# Altium schematic sheet Ctrl-PWM.SchDoc: I2C to PWM Controller
size Letter; ApprovedBy: k.cotton; Engineer: K.Cotton; Organization: Cegep Limoilou; Address1: 1300, 8e Avenue; Address2: Québec, QC; Address3: Canada; Address4: G1J 5L5; SheetNumber: 4; SheetTotal: 5
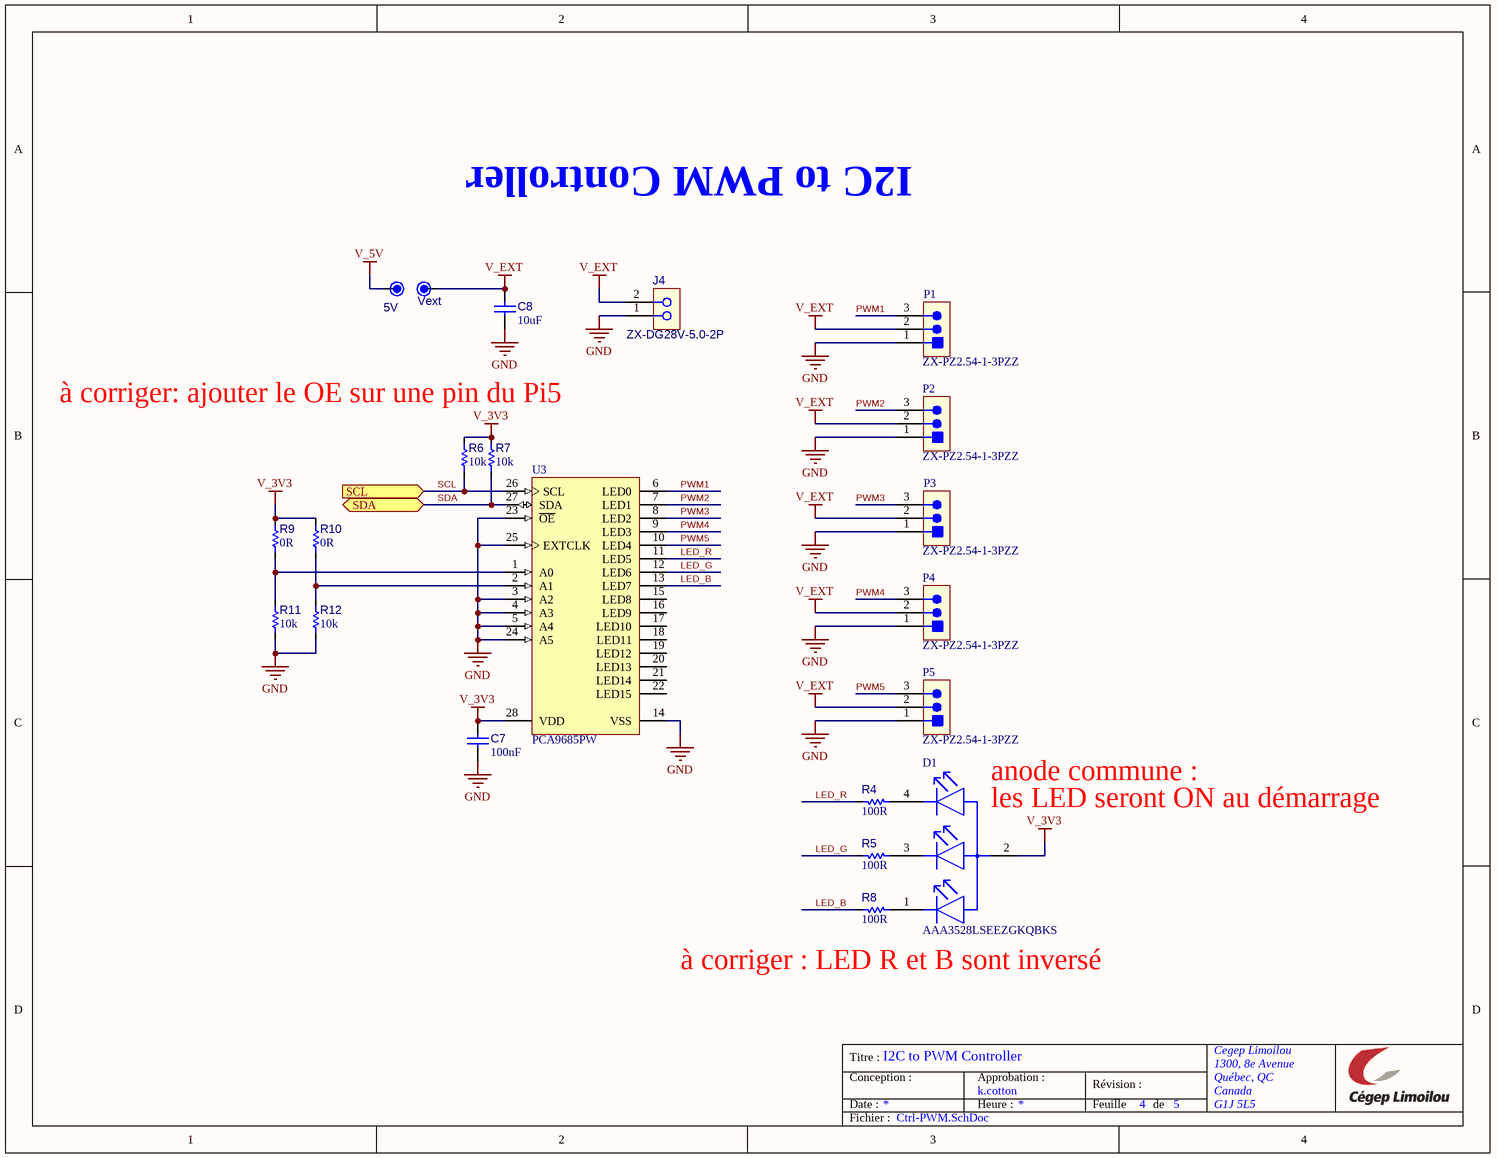
[diagram p0: Ctrl-PWM.SchDoc]

## Parts
5V  DNP  [TP_TH061]  (value not drawn)  (no BOM)
C7  value 100nF  [C_1005[0402]]  (hidden comment: CAP CER 100nF 50V 0402)
C8  value 10uF  [C_2012[0805]]  (hidden comment: CAP CER 10uF 10V X7R 0805)
D1  AAA3528LSEEZGKQBKS  [FP-AAA3528LSEEZGKQBKS-MFG]
J4  ZX-DG28V-5.0-2P  [CONN_TERM_BLOCK_2POS_5mm_Model1]
P1  ZX-PZ2.54-1-3PZZ  [CONN_HDR_3POS_100MILS_TH]
P2  ZX-PZ2.54-1-3PZZ  [CONN_HDR_3POS_100MILS_TH]
P3  ZX-PZ2.54-1-3PZZ  [CONN_HDR_3POS_100MILS_TH]
P4  ZX-PZ2.54-1-3PZZ  [CONN_HDR_3POS_100MILS_TH]
P5  ZX-PZ2.54-1-3PZZ  [CONN_HDR_3POS_100MILS_TH]
R4  value 100R  [R_1608[0603]]  (hidden comment: Res 100R 1% 0603)
R5  value 100R  [R_1608[0603]]  (hidden comment: Res 100R 1% 0603)
R6  value 10k  [R_1005[0402]]  (hidden comment: Res 10k 1% 0402)
R7  value 10k  [R_1005[0402]]  (hidden comment: Res 10k 1% 0402)
R8  value 100R  [R_1608[0603]]  (hidden comment: Res 100R 1% 0603)
R9  value 0R  [R_1005[0402]]  (hidden comment: DNP)  (no BOM)
R10  value 0R  [R_1005[0402]]  (hidden comment: DNP)  (no BOM)
R11  value 10k  [R_1005[0402]]  (hidden comment: Res 10k 1% 0402)
R12  value 10k  [R_1005[0402]]  (hidden comment: Res 10k 1% 0402)
U3  PCA9685PW  [TSSOP28_SOT361-1_V]
Vext  DNP  [TP_TH061]  (value not drawn)  (no BOM)

## Ports
SCL (in, see 243-5xx_Pi-CAN-PWM[2B], Pi5-Interface[2B], PMOD-T3-T6[2C]), SDA (bidir, see 243-5xx_Pi-CAN-PWM[2B], Pi5-Interface[2B], PMOD-T3-T6[2C])

## Nets
GND: C7.1 C8.1 J4.1 P1.1 P2.1 P3.1 P4.1 P5.1 R11.1 R12.1 U3.3(A2) U3.4(A3) U3.5(A4) U3.14(VSS) U3.23(~{OE}) U3.24(A5) U3.25(EXTCLK)
V_3V3: C7.2 D1.2(COMMON_ANODE) R6.2 R7.2 R9.2 R10.2 U3.28(VDD)
V_5V: 5V.1
V_EXT: C8.2 J4.2 P1.2 P2.2 P3.2 P4.2 P5.2 Vext.1
LED_B: R8.2 U3.13(LED7)
LED_G: R5.2 U3.12(LED6)
LED_R: R4.2 U3.11(LED5)
PWM1: P1.3 U3.6(LED0)
PWM2: P2.3 U3.7(LED1)
PWM3: P3.3 U3.8(LED2)
PWM4: P4.3 U3.9(LED3)
PWM5: P5.3 U3.10(LED4)
SCL: R6.1 U3.26(SCL) ; port SCL
SDA: R7.1 U3.27(SDA) ; port SDA
NetD1_1: D1.1(RED_C) R8.1
NetD1_3: D1.3(GREEN_C) R5.1
NetD1_4: D1.4(BLUE_C) R4.1
NetR9_1: R9.1 R11.2 U3.1(A0)
NetR10_1: R10.1 R12.2 U3.2(A1)

Not connected (* = marked no-connect by the designer): U3 15(LED8) 16(LED9) 17(LED10) 18(LED11) 19(LED12) 20(LED13) 21(LED14) 22(LED15)

## Notes on the sheet
- à corriger: ajouter le OE sur une pin du Pi5
- (near D1) anode commune :
- (near D1) les LED seront ON au démarrage
- à corriger : LED R et B sont inversé
- Titre :
- Conception :
- Date :
- Approbation :
- Heure :
- Révision :
- Feuille
- de
- Fichier :

## Library data of the parts
5V Vext = TP_TH0.61mm(AWG28): Pad TH 0.61mm diameter (AWG28); Value: DNP; Manufacturer Part Number 1: DNP; Supplier Part Number 1: N/A; Supplier 1: N/A
C7 = CAP001: Capacitor type 1; Manufacturer 1: Yageo; Manufacturer Part Number 1: CC0402KRX7R9BB104; LibRef: CAP001; Code CEGEP: KCOND01SM; Tolerance: 10%; Dielectric: X7R; Rated Voltage: 50V; Mounting Technology: SMT; Supplier 1: LCSC; Supplier Part Number 1: C131394
C8 = CAP004: Capacitor type 1; Manufacturer 1: muRata; Manufacturer Part Number 1: GRM21BR71A106KE51L; LibRef: CAP004; Code CEGEP: KCOND03SM; Tolerance: 10%; Rated Voltage: 10V; Dielectric: X7R; Mounting Technology: SMT; Supplier 1: LCSC; Supplier Part Number 1: C86038
D1 = CMP-44529-000043-1: LED RGB CLEAR 4SMD; Dominant Wavelength: 465nm; Test Current: 2mA; Color: Blue; Forward Voltage: 2.7V; Viewing Angle: 120°; Luminous Intensity: 30mcd; Lens Color: Colorless; Case/Package: PLCC; Packaging: Tape and Reel; Number of Pins: 4; Width: 2.8mm; Lens Transparency: Clear; Mount: Surface Mount; Height: 2.1mm; Length: 3.2mm
J4 = CONN-5MM-2POS-TERM-BLOCK: CONN TERM BLOCK 2POS 5mm pitch; Manufacturer 1: Megastar; Code CEGEP: CONWECO0002; Localisation: R13-B113; Supplier 1: LCSC; Supplier Part Number 1: C49022995; Manufacturer Part Number 1: ZX-DG28V-5.0-2P; Mounting Technology: TH; Manufacturer 2: Weidmüller - Phoenix Contact; Manufacturer Part Number 2: 1760510000 - 1890963
P1-P5 = CONN-100MIL-HDR-01X03: CONN HEADER 3pins single row, 100 mils TH; Manufacturer 1: Megastar; Manufacturer Part Number 1: ZX-PZ2.54-1-3PZZ; Mounting Technology: TH; Supplier 1: LCSC; Supplier Part Number 1: C7501261
R4 R5 R8 = RES029: Resistor type 1; Manufacturer 1: Yageo; Manufacturer Part Number 1: RC0603FR-07100RL; LibRef: RES029; Puissance: 1/10W; Max Working Voltage: 75V; Tolerance: 1%; Mounting Technology: SMT; Supplier 1: LCSC; Supplier Part Number 1: C105588
R6 R7 R11 R12 = RES003: Resistor type 1; Manufacturer 1: Yageo; Manufacturer Part Number 1: RC0402FR-0710KL; LibRef: RES003; Puissance: 1/16W; Max Working Voltage: 50V; Tolerance: 1%; Mounting Technology: SMT; Supplier 1: LCSC; Supplier Part Number 1: C60490
R9 R10 = RES005: Resistor type 1; Manufacturer 1: Yageo; Manufacturer Part Number 1: RC0402JR-070RL; LibRef: RES005; Code CEGEP: RES0SM; Max Working Voltage: 50V; Mounting Technology: SMT; Supplier 1: LCSC; Supplier Part Number 1: C60485
U3 = U_PCA9685PW: 16-Channel, 12-Bit PWM I2C-Bus LED Controller, 28-Pin TSSOP (SOT361-1); Manufacturer 1: NXP; Manufacturer Part Number 1: PCA9685PW,112; Mount: SMT; Supplier 1: Digi-Key; Supplier Part Number 1: 568-8366-5-ND